# Altium schematic sheet 电源调压板.SchDoc
size A4; PageSetup: Record=PageOptions|CenterHorizontal=True|CenterVertical=True|PrintScale=0.97|XCorrection=1.00|YCorrection=1.00|PrintKind=1|BorderSize=5000000|LeftOffset=0|BottomOffset=0|Orientation=2|PaperLength=1000|PaperWidth=1000|Scale=100|PaperSource=15|PrintQuality=600|MediaType=1|DitherType=10|PaperKind=A3|PrintScaleMode=1
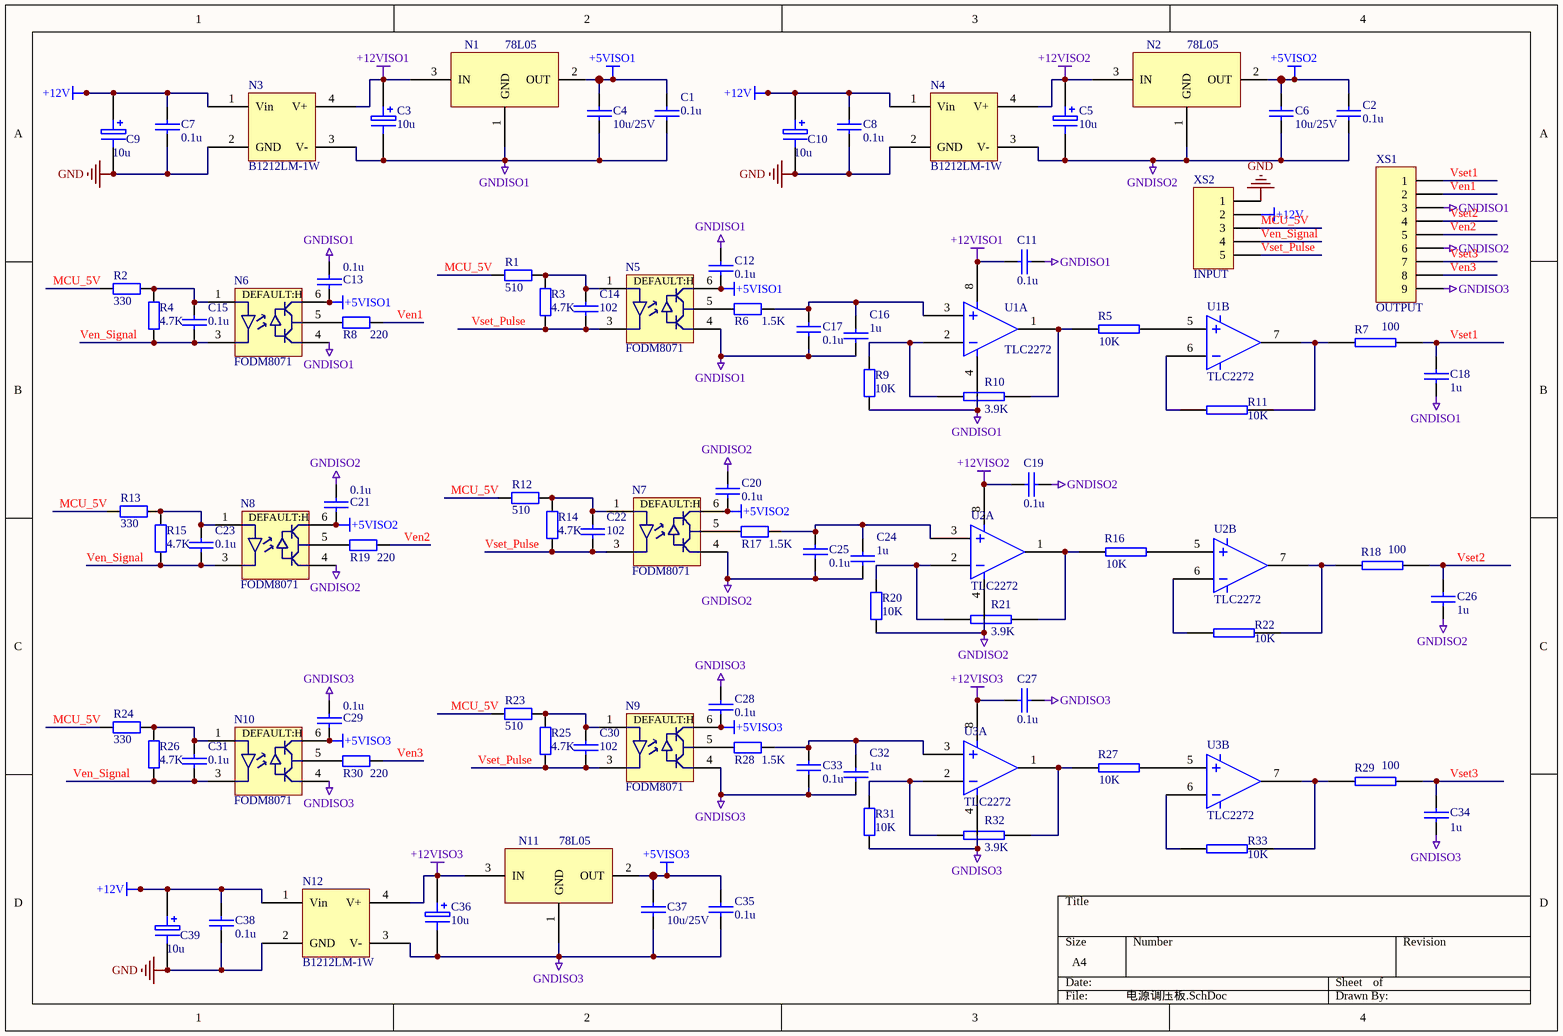
[diagram p0: 电源调压板.SchDoc]

## Parts
C1  0.1u  [0805]
C2  0.1u  [0805]
C3  10u  [1206]
C4  10u/25V  [1206]
C5  10u  [1206]
C6  10u/25V  [1206]
C7  0.1u  [0805]
C8  0.1u  [0805]
C9  10u  [1206]
C10  10u  [1206]
C11  0.1u  [0805]
C12  0.1u  [0805]
C13  0.1u  [0805]
C14  102  [0805]
C15  0.1u  [0805]
C16  1u  [0805]
C17  0.1u  [0805]
C18  1u  [0805]
C19  0.1u  [0805]
C20  0.1u  [0805]
C21  0.1u  [0805]
C22  102  [0805]
C23  0.1u  [0805]
C24  1u  [0805]
C25  0.1u  [0805]
C26  1u  [0805]
C27  0.1u  [0805]
C28  0.1u  [0805]
C29  0.1u  [0805]
C30  102  [0805]
C31  0.1u  [0805]
C32  1u  [0805]
C33  0.1u  [0805]
C34  1u  [0805]
C35  0.1u  [0805]
C36  10u  [1206]
C37  10u/25V  [1206]
C38  0.1u  [0805]
C39  10u  [1206]
N1  78L05  [TO-92_2]
N2  78L05  [TO-92_2]
N3  B1212LM-1W  [B0505LS]
N4  B1212LM-1W  [B0505LS]
N5  FODM8071  [SO-6]
N6  FODM8071  [SO-6]
N7  FODM8071  [SO-6]
N8  FODM8071  [SO-6]
N9  FODM8071  [SO-6]
N10  FODM8071  [SO-6]
N11  78L05  [TO-92_2]
N12  B1212LM-1W  [B0505LS]
R1  510  [1206]
R2  330  [1206]
R3  4.7K  [0805]
R4  4.7K  [0805]
R5  10K  [0805]
R6  1.5K  [0805]
R7  100  [0805]
R8  220  [0805]
R9  10K  [0805]
R10  3.9K  [0805]
R11  10K  [0805]
R12  510  [1206]
R13  330  [1206]
R14  4.7K  [0805]
R15  4.7K  [0805]
R16  10K  [0805]
R17  1.5K  [0805]
R18  100  [0805]
R19  220  [0805]
R20  10K  [0805]
R21  3.9K  [0805]
R22  10K  [0805]
R23  510  [1206]
R24  330  [1206]
R25  4.7K  [0805]
R26  4.7K  [0805]
R27  10K  [0805]
R28  1.5K  [0805]
R29  100  [0805]
R30  220  [0805]
R31  10K  [0805]
R32  3.9K  [0805]
R33  10K  [0805]
U1  TLC2272  [SO-8]  (parts A,B of 2)
U2  TLC2272  [SO-8]  (parts A,B of 2)
U3  TLC2272  [SO-8]  (parts A,B of 2)
XS1  OUTPUT  [sip-9]
XS2  INPUT  [sip-5]

## Nets
+5VISO1: C1.1 C4.1 C12.1 C13.1 N1.2(OUT) N5.6(VDD) N6.6(VDD)
+5VISO2: C2.1 C6.1 C20.1 C21.1 N2.2(OUT) N7.6(VDD) N8.6(VDD)
+5VISO3: C28.1 C29.1 C35.1 C37.1 N9.6(VDD) N10.6(VDD) N11.2(OUT)
+12V: C7.1 C8.1 C9.1 C10.1 C38.1 C39.1 N3.1(Vin) N4.1(Vin) N12.1(Vin) XS2.2
+12VISO1: C3.1 C11.1 N1.3(IN) N3.4(V+) U1.8
+12VISO2: C5.1 C19.1 N2.3(IN) N4.4(V+) U2.8
+12VISO3: C27.1 C36.1 N11.3(IN) N12.4(V+) U3.8
GND: C7.2 C8.2 C9.2 C10.2 C38.2 C39.2 N3.2(GND) N4.2(GND) N12.2(GND) XS2.1
GNDISO1: C1.2 C3.2 C4.2 C11.2 C12.2 C13.2 C16.1 C17.1 C18.2 N1.1(GND) N3.3(V-) N5.4(GND) N6.4(GND) R9.1 U1.4 XS1.3
GNDISO2: C2.2 C5.2 C6.2 C19.2 C20.2 C21.2 C24.1 C25.1 C26.2 N2.1(GND) N4.3(V-) N7.4(GND) N8.4(GND) R20.1 U2.4 XS1.6
GNDISO3: C27.2 C28.2 C29.2 C32.1 C33.1 C34.2 C35.2 C36.2 C37.2 N9.4(GND) N10.4(GND) N11.1(GND) N12.3(V-) R31.1 U3.4 XS1.9
MCU_5V: R1.2 R2.2 R12.2 R13.2 R23.2 R24.2 XS2.3
Ven1: R8.1 XS1.2
Ven2: R19.1 XS1.5
Ven3: R30.1 XS1.8
Ven_Signal: C15.1 C23.1 C31.1 N6.3(IN-) N8.3(IN-) N10.3(IN-) R4.2 R15.2 R26.2 XS2.4
Vset1: C18.1 R7.2 XS1.1
Vset2: C26.1 R18.2 XS1.4
Vset3: C34.1 R29.2 XS1.7
Vset_Pulse: C14.1 C22.1 C30.1 N5.3(IN-) N7.3(IN-) N9.3(IN-) R3.2 R14.2 R25.2 XS2.5
NetC14_2: C14.2 N5.1(IN+) R1.1 R3.1
NetC15_2: C15.2 N6.1(IN+) R2.1 R4.1
NetC16_2: C16.2 C17.2 R6.1 U1.3
NetC22_2: C22.2 N7.1(IN+) R12.1 R14.1
NetC23_2: C23.2 N8.1(IN+) R13.1 R15.1
NetC24_2: C24.2 C25.2 R17.1 U2.3
NetC30_2: C30.2 N9.1(IN+) R23.1 R25.1
NetC31_2: C31.2 N10.1(IN+) R24.1 R26.1
NetC32_2: C32.2 C33.2 R28.1 U3.3
NetN5_5: N5.5(VO) R6.2
NetN6_5: N6.5(VO) R8.2
NetN7_5: N7.5(VO) R17.2
NetN8_5: N8.5(VO) R19.2
NetN9_5: N9.5(VO) R28.2
NetN10_5: N10.5(VO) R30.2
NetR5_1: R5.1 R10.2 U1.1
NetR5_2: R5.2 U1.5
NetR7_1: R7.1 R11.2 U1.7
NetR9_2: R9.2 R10.1 U1.2
NetR11_1: R11.1 U1.6
NetR16_1: R16.1 R21.2 U2.1
NetR16_2: R16.2 U2.5
NetR18_1: R18.1 R22.2 U2.7
NetR20_2: R20.2 R21.1 U2.2
NetR22_1: R22.1 U2.6
NetR27_1: R27.1 R32.2 U3.1
NetR27_2: R27.2 U3.5
NetR29_1: R29.1 R33.2 U3.7
NetR31_2: R31.2 R32.1 U3.2
NetR33_1: R33.1 U3.6

Not connected (* = marked no-connect by the designer): N5 2(NC); N6 2(NC); N7 2(NC); N8 2(NC); N9 2(NC); N10 2(NC)

## Notes on the sheet
- (in symbol FODM8071) DEFAULT:H

## Library data of the parts
C1 C2 C4 C6 C12-C17 C20-C25 C28-C33 C35 C37 = CAP
C3 C5 C9 C10 C36 C39 = ELECTRO1: Electrolytic Capacitor
C7 C8 C11 C18 C19 C26 C27 C34 C38 = CAP: Capacitor
N1 N2 N11 = VOL
N3 N4 N12 = B0505LM
R1-R4 R6 R8 R9 R12-R15 R17 R19 R20 R23-R26 R28 R30 R31 = Res2: Resistor; Value: 1K; Published: 8-Jun-2000; LatestRevisionDate: 17-Jul-2002; LatestRevisionNote: Re-released for DXP Platform.; PackageReference: AXIAL-0.4; Publisher: Altium Limited
R5 R7 R10 R11 R16 R18 R21 R22 R27 R29 R32 R33 = RES2
U1-U3 = 1458
XS1 = Header 9: Header, 9-Pin; LatestRevisionDate: 17-Jul-2002; LatestRevisionNote: Re-released for DXP Platform.; Publisher: Altium Limited
XS2 = Header 5: Header, 5-Pin; LatestRevisionDate: 17-Jul-2002; LatestRevisionNote: Re-released for DXP Platform.; Publisher: Altium Limited